# Altium schematic sheet Driver_Open Collector.SchDoc
size 50 x 38 mm
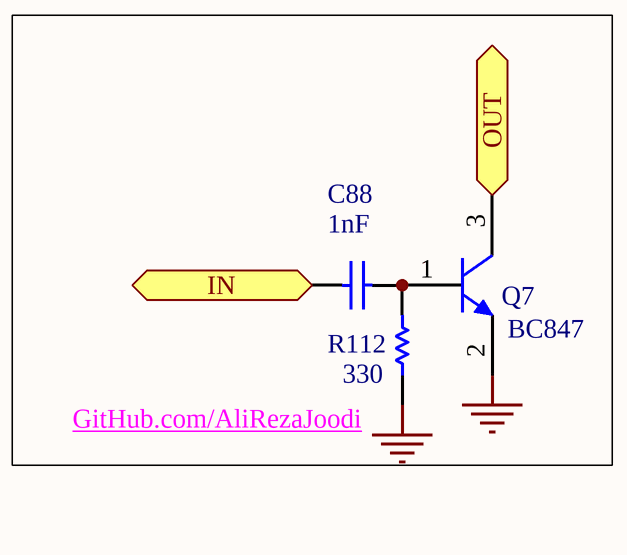
[diagram p0: Driver_Open Collector.SchDoc]

## Parts
C88  value 1nF  [RESC3216N]  (hidden comment: Cap)
Q7  value BC847  [SOT23-3N]  (hidden comment: NPN)
R112  value 330  [0805]  (hidden comment: Res1)

## Ports
IN (in), OUT (out)

## Nets
GND: Q7.2(E) R112.1
IN: C88.1 ; port IN
OUT: Q7.3(C) ; port OUT
NetC88_2: C88.2 Q7.1(B) R112.2

## Notes on the sheet
- (near R112) GitHub.com/AliRezaJoodi

## Library data of the parts
C88 = Cap: Capacitor; Published: 8-Jun-2000; LatestRevisionDate: 17-Jul-2002; LatestRevisionNote: Re-released for DXP Platform.; PackageReference: RAD-0.3; Publisher: Altium Limited
Q7 = BC847: Silicon Bipolar Transistor
R112 = Res1: Resistor; Published: 8-Jun-2000; LatestRevisionDate: 17-Jul-2002; LatestRevisionNote: Re-released for DXP Platform.; PackageReference: AXIAL-0.3; Publisher: Altium Limited